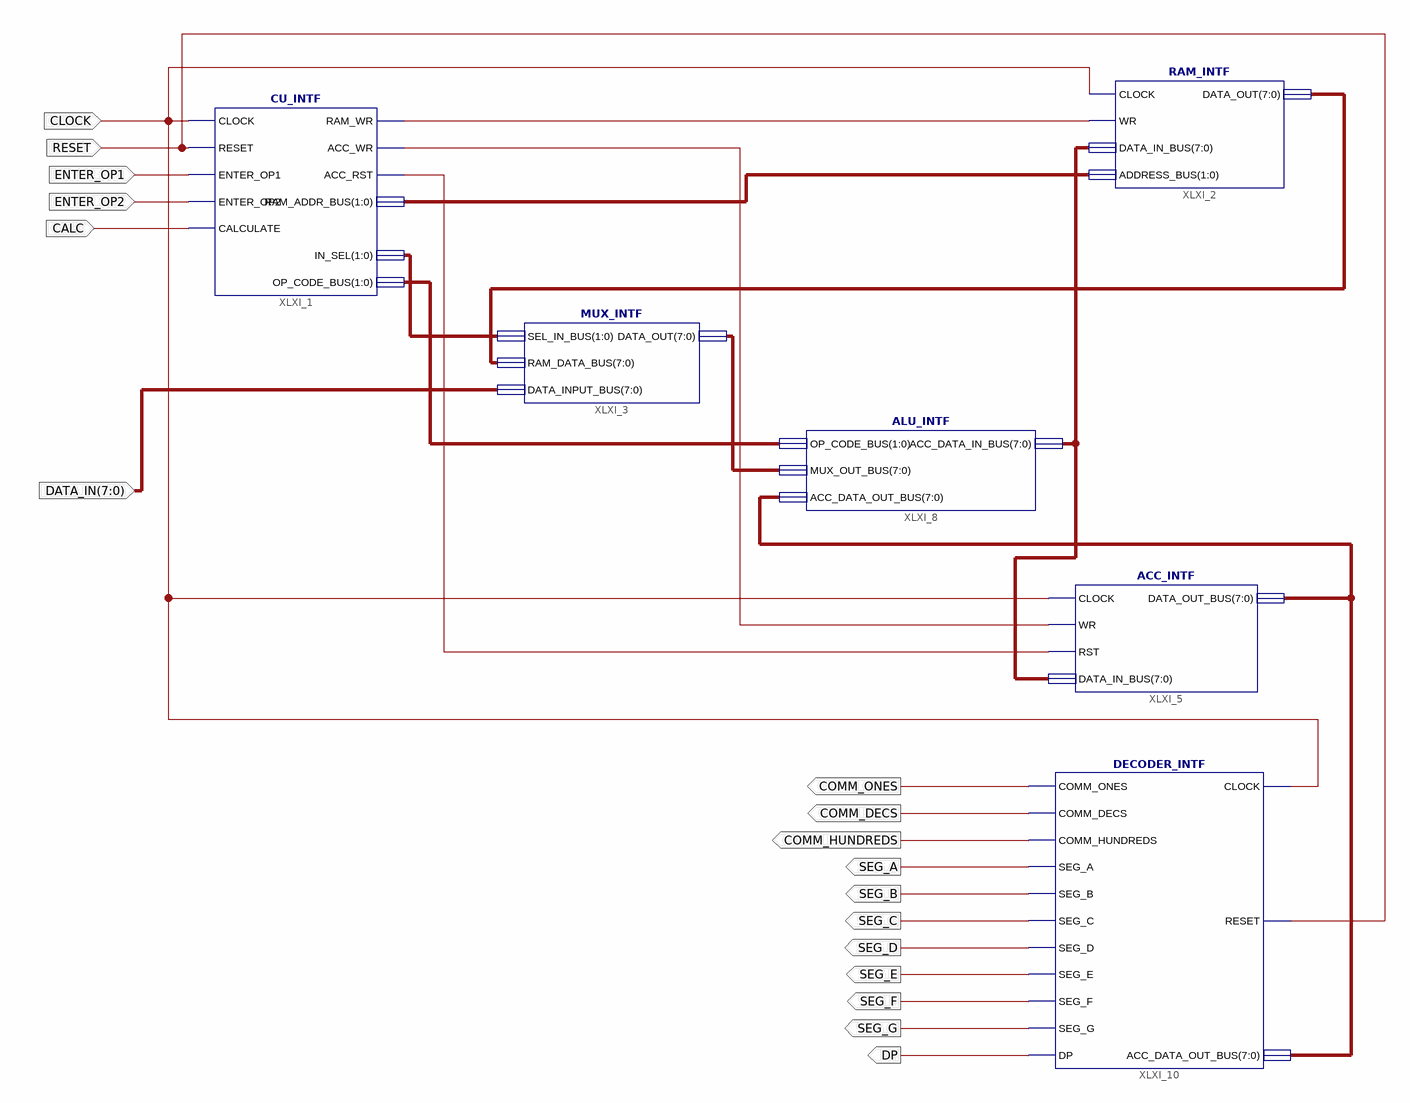
[diagram p0: schematic sheet 1]
// Xilinx ISE schematic top_level.sch (spartan3a) as structural Verilog: 6 symbols, 17 ports
module top_level (
  input  [7:0] DATA_IN,
  input  ENTER_OP1,
  input  ENTER_OP2,
  input  CALC,
  input  RESET,
  input  CLOCK,
  output COMM_ONES,
  output COMM_DECS,
  output COMM_HUNDREDS,
  output SEG_A,
  output SEG_B,
  output SEG_C,
  output SEG_D,
  output SEG_E,
  output SEG_F,
  output SEG_G,
  output DP
);

  wire ACC_RST, ACC_WR, RAM_WR;
  wire [1:0] IN_SEL, OP_CODE, RAM_ADDR;
  wire [7:0] ACC_OUT, ALU_OUT, MUX_OUT, RAM_OUT;

  CU_INTF XLXI_1 (
    .CLOCK(CLOCK), .RESET(RESET), .ENTER_OP1(ENTER_OP1), .ENTER_OP2(ENTER_OP2), .CALCULATE(CALC),
    .RAM_WR(RAM_WR), .ACC_WR(ACC_WR), .ACC_RST(ACC_RST), .RAM_ADDR_BUS(RAM_ADDR), .IN_SEL(IN_SEL),
    .OP_CODE_BUS(OP_CODE));
  RAM_INTF XLXI_2 (.CLOCK(CLOCK), .WR(RAM_WR), .DATA_IN_BUS(ALU_OUT), .ADDRESS_BUS(RAM_ADDR), .DATA_OUT(RAM_OUT));
  MUX_INTF XLXI_3 (.SEL_IN_BUS(IN_SEL), .RAM_DATA_BUS(RAM_OUT), .DATA_INPUT_BUS(DATA_IN), .DATA_OUT(MUX_OUT));
  ACC_INTF XLXI_5 (.CLOCK(CLOCK), .WR(ACC_WR), .RST(ACC_RST), .DATA_IN_BUS(ALU_OUT), .DATA_OUT_BUS(ACC_OUT));
  ALU_INTF XLXI_8 (.OP_CODE_BUS(OP_CODE), .MUX_OUT_BUS(MUX_OUT), .ACC_DATA_OUT_BUS(ACC_OUT), .ACC_DATA_IN_BUS(ALU_OUT));
  DECODER_INTF XLXI_10 (
    .CLOCK(CLOCK), .RESET(RESET), .ACC_DATA_OUT_BUS(ACC_OUT), .COMM_ONES(COMM_ONES), .COMM_DECS(COMM_DECS),
    .COMM_HUNDREDS(COMM_HUNDREDS), .SEG_A(SEG_A), .SEG_B(SEG_B), .SEG_C(SEG_C), .SEG_D(SEG_D), .SEG_E(SEG_E),
    .SEG_F(SEG_F), .SEG_G(SEG_G), .DP(DP));
endmodule
